# EAGLE design bunny_light (EAGLE 7.5.0)
CNAME: Arduino Bunny Nightlight; CREVISION: 1.1; DESIGNER: Nikita Pchelin
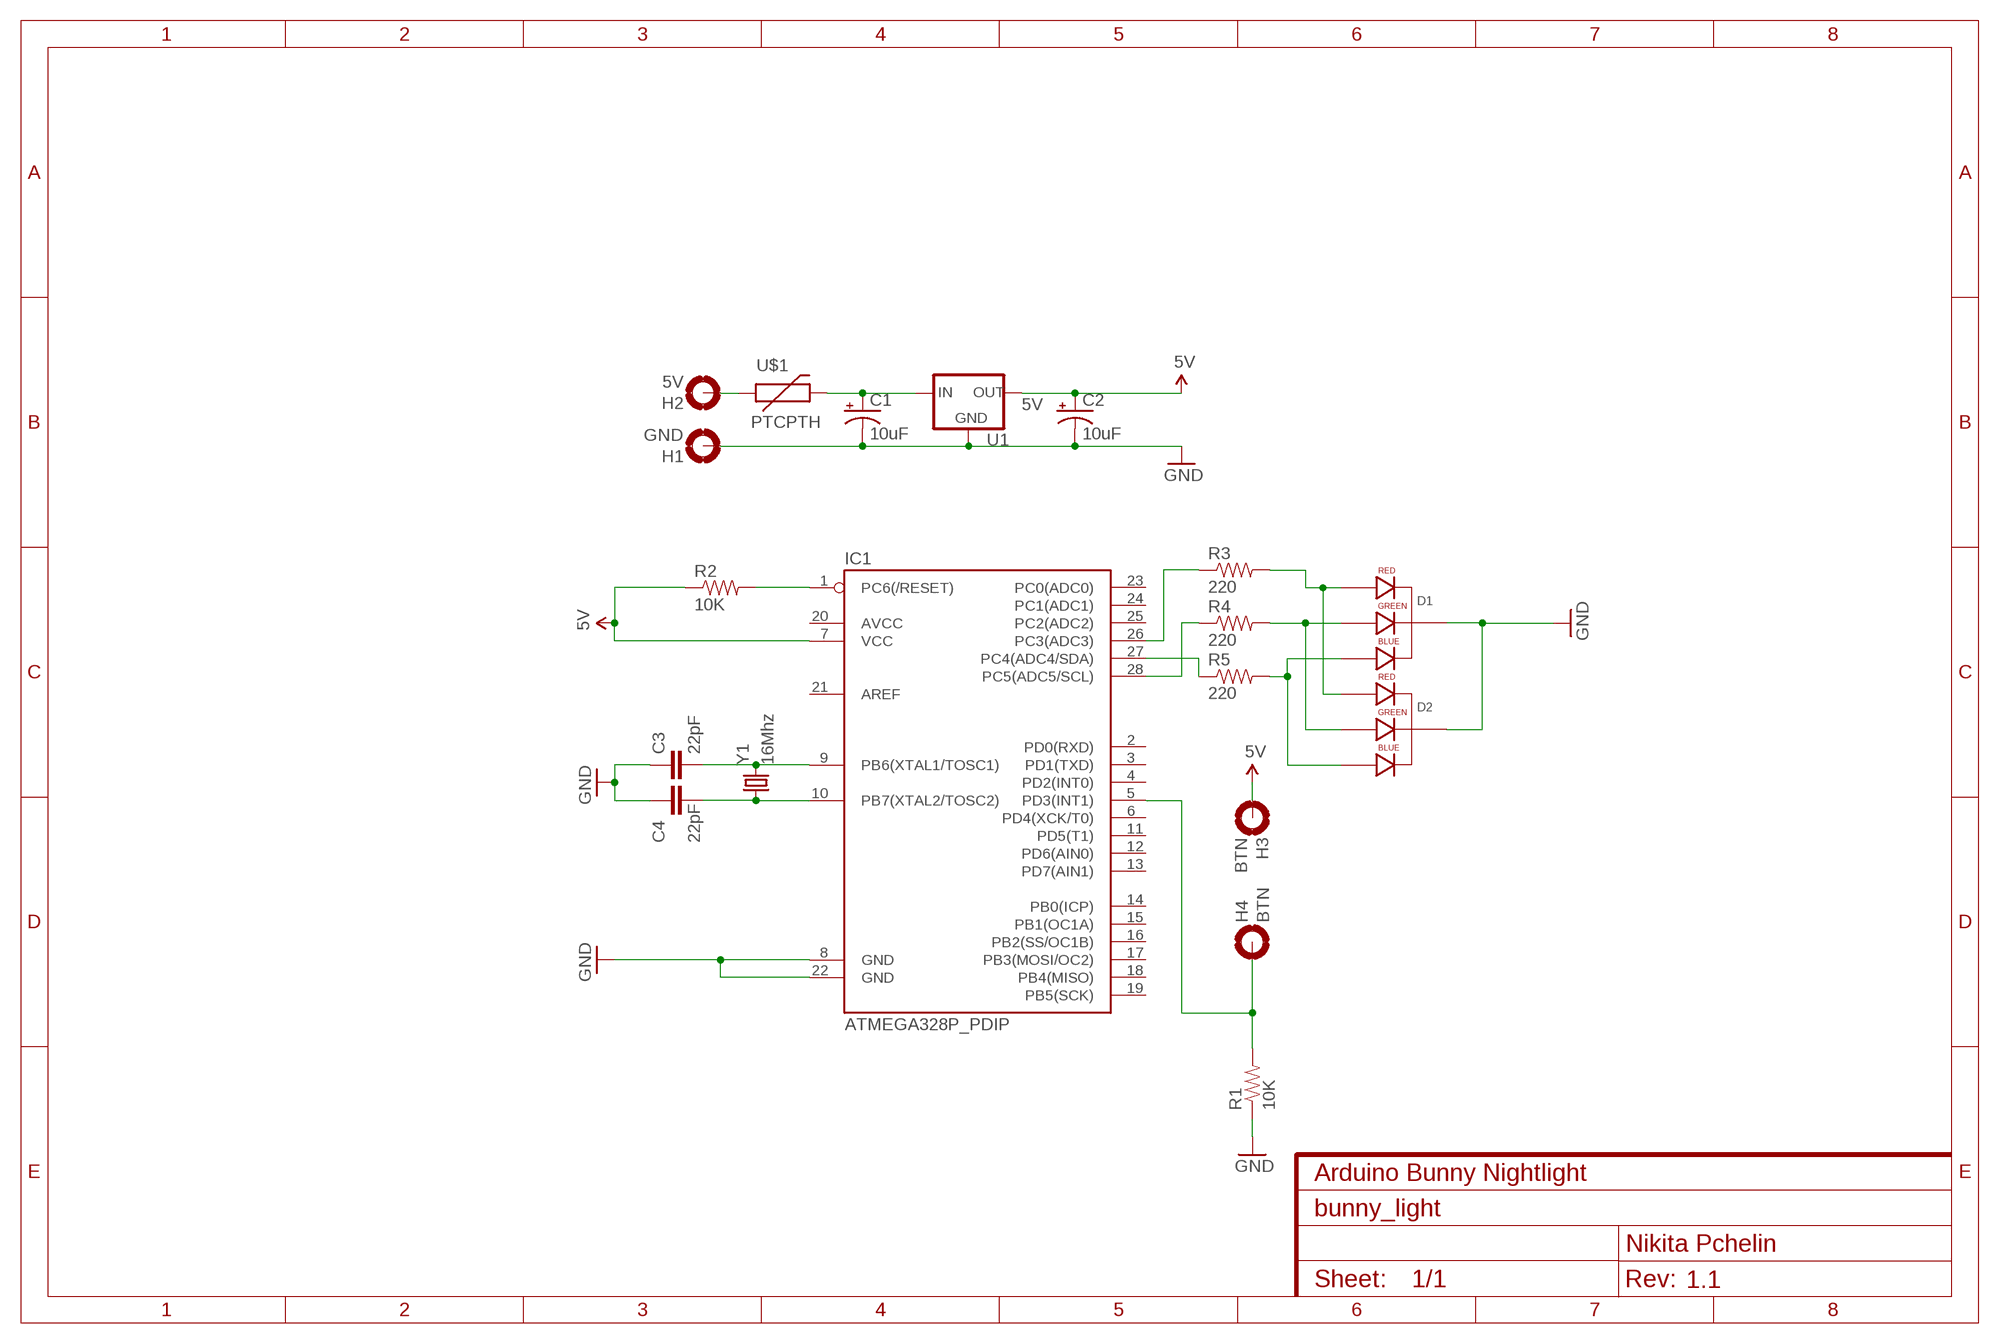
[diagram p0: schematic, sheet 1]

## Parts
C1  10uF  CAP_POLPTH1  [CPOL-RADIAL-100UF-25V]
C2  10uF  CAP_POLPTH1  [CPOL-RADIAL-100UF-25V]
C3  22pF  CAP_  [AXIAL-5MM]
C4  22pF  CAP_  [AXIAL-5MM]
D1  LED-RGB-CC-THRUCLEAR  [LED-RGB-THRU]
D2  LED-RGB-CC-THRUCLEAR  [LED-RGB-THRU]
H1  GND  MOUNT-PAD-ROUND2.8  [2,8-PAD]
H2  5V  MOUNT-PAD-ROUND2.8  [2,8-PAD]
H3  BTN  MOUNT-PAD-ROUND2.8  [2,8-PAD]
H4  BTN  MOUNT-PAD-ROUND2.8  [2,8-PAD]
IC1  ATMEGA328P_PDIP  [DIL28-3]
R1  10K  RESISTOREZ  [AXIAL-0.3EZ]
R2  10K  RESISTOREZ  [AXIAL-0.3EZ]
R3  220  RESISTOREZ  [AXIAL-0.3EZ]
R4  220  RESISTOREZ  [AXIAL-0.3EZ]
R5  220  RESISTOREZ  [AXIAL-0.3EZ]
U1  5V  V_REG_78XXSIDE  [78XXL]
U$1  PTCPTH  [PTC]
Y1  16Mhz  CRYSTALHC49US  [HC49US]

## Nets
5V: C2.1(+) H3.B2,8(MOUNT) IC1.7(VCC) R2.P$1 U1.OUT
GND: C1.2(-) C2.2(-) C3.P$1 C4.P$1 D1.2(CATHODE) D2.2(CATHODE) H1.B2,8(MOUNT) IC1.8(GND) IC1.22(GND) R1.P$1 U1.GND
N$1: C1.1(+) U1.IN U$1.P$2
N$2: C3.P$2 IC1.9(PB6(XTAL1/TOSC1)) Y1.2
N$3: C4.P$2 IC1.10(PB7(XTAL2/TOSC2)) Y1.1
N$4: IC1.1(PC6(/RESET)) R2.P$2
N$5: H4.B2,8(MOUNT) IC1.5(PD3(INT1)) R1.P$2
N$6: D1.1(RED_CATHODE) D2.1(RED_CATHODE) R3.P$2
N$7: D1.3(GREEN_CATHODE) D2.3(GREEN_CATHODE) R4.P$2
N$8: D1.4(BLUE_CATHODE) D2.4(BLUE_CATHODE) R5.P$2
N$9: IC1.26(PC3(ADC3)) R3.P$1
N$10: IC1.28(PC5(ADC5/SCL)) R4.P$1
N$11: IC1.27(PC4(ADC4/SDA)) R5.P$1
N$12: H2.B2,8(MOUNT) U$1.P$1
Unconnected: IC1.2(PD0(RXD)) IC1.3(PD1(TXD)) IC1.4(PD2(INT0)) IC1.6(PD4(XCK/T0)) IC1.11(PD5(T1)) IC1.12(PD6(AIN0)) IC1.13(PD7(AIN1)) IC1.14(PB0(ICP)) IC1.15(PB1(OC1A)) IC1.16(PB2(SS/OC1B)) IC1.17(PB3(MOSI/OC2)) IC1.18(PB4(MISO)) IC1.19(PB5(SCK)) IC1.20(AVCC) IC1.21(AREF) IC1.23(PC0(ADC0)) IC1.24(PC1(ADC1)) IC1.25(PC2(ADC2))

## Library data of the parts
C1 C2 = SparkFun-Capacitors:CAP_POL: Capacitor Polarized These are standard SMD and PTH capacitors. Normally 10uF, 47uF, and 100uF in electrolytic and tantalum varieties. Always verify the external diameter of the through hole cap, it varies with capacity, voltage, and manufacturer. The EIA devices should be standard.
C3 C4 = SparkFun-Passives:CAP: Capacitor Standard 0603 ceramic capacitor, and 0.1" leaded capacitor.
D1 D2 = SparkFun-LED:LED-RGB-CC-THRU: RGB Through-hole common cathode LED SparkFun Storefront: COM-00105 (Clear) COM-09264 (Diffuse); PROD_ID: DIO-08418
H1-H4 = holes:MOUNT-PAD-ROUND: MOUNTING PAD, round
IC1 = SparkFun-DigitalIC:ATMEGA328P_PDIP: uC used in the Arduino 32kb flash, 1k EEPROM, 2k SRAM This is the through-hole version of this chip.
R1-R5 = SparkFun-Resistors:RESISTOR: Resistor Basic schematic elements and footprints for 0603, 1206, and PTH resistors.
U1 = SparkFun-PowerIC:V_REG_78XX: Voltage Regulator Standard 78xx regulator. IGO (Input Ground Output). Spark Fun Electronics SKU : COM-00107
U$1 = SparkFun-PowerIC:PTC: Resettable Fuse PTC Resettable Fuse. Spark Fun Electronics SKU : COM-08357
Y1 = SparkFun-FreqCtrl:CRYSTAL: Various standard crystals. Proven footprints.

## Board
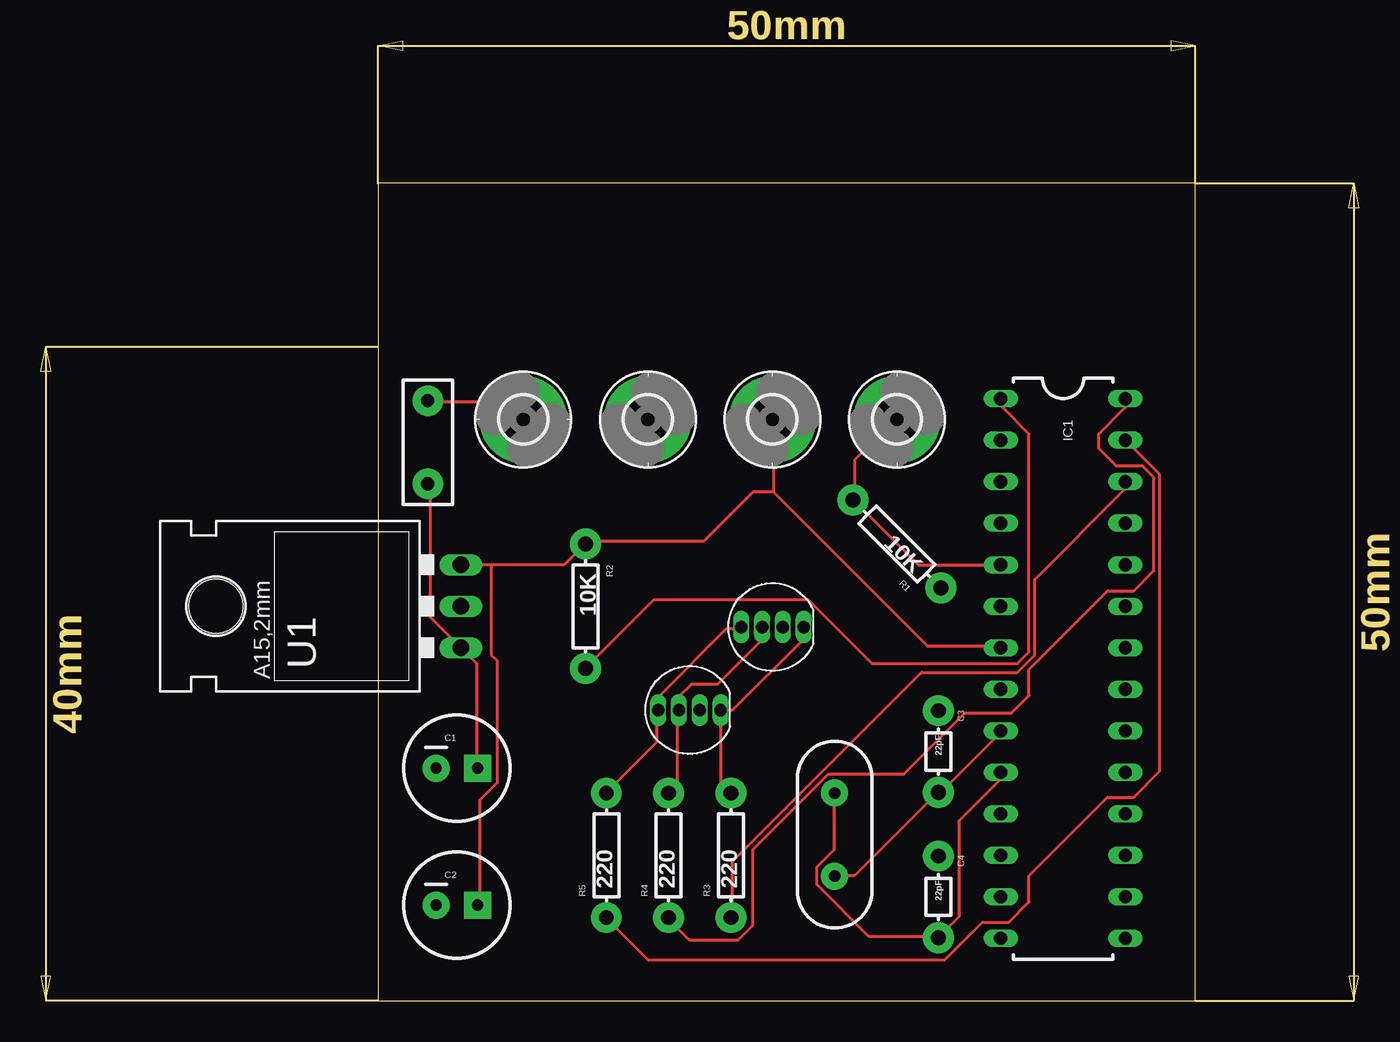
[diagram p1: board, top side]
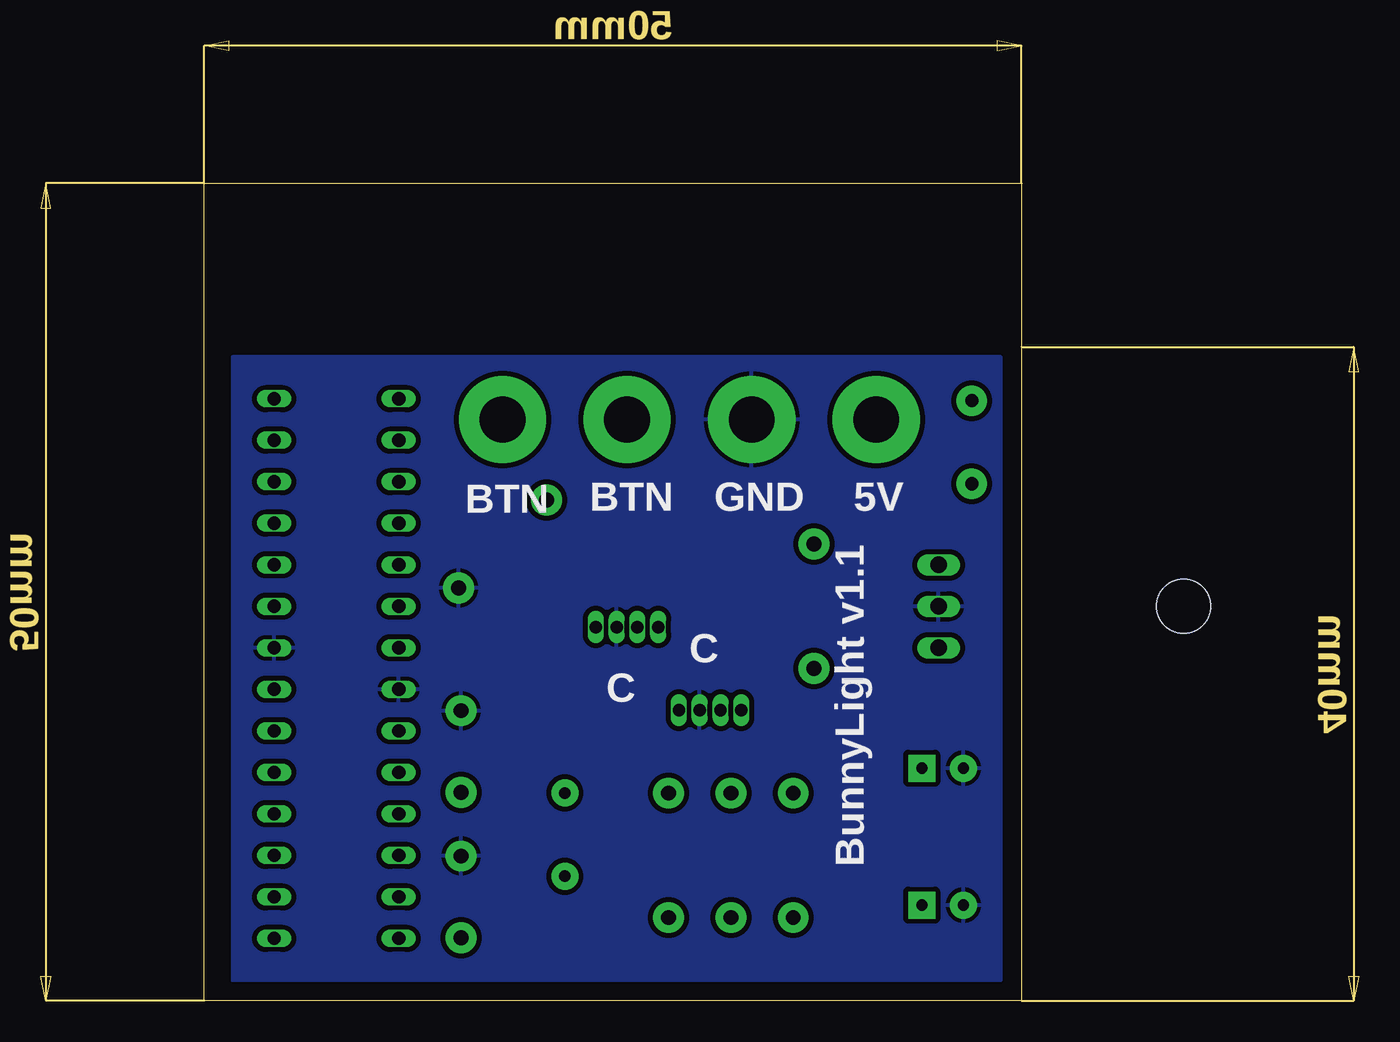
[diagram p2: board, bottom side, seen from below]

Size 50 x 50 mm. Coordinates in mm from the lower left corner, seen from the top.
Outline: 0,0 50,0 50,50 0,50 0,0
Copper layers (1*16): Top 0.035mm / dielectric 1.5mm / Bottom 0.035mm
Design rules "ShenZhen2U EagleRules *": minimum track width 7mil, minimum drill 12mil, track to track 7mil, track to pad 7mil, pad to pad 7mil, via to via 7mil, smd to smd 0mil, copper to edge 20mil, drill to drill 10mil, minimum pad ring 0mil, minimum via ring 6mil, stop-mask expansion 2mil, vias tented up to drill 25mil, thermal gap 10mil

### Footprints (pad centres in the part's own frame; a part is rotated, then mirrored left to right if it is on the bottom)
CPOL-RADIAL-100UF-25V = drill 0.7 pad 1.651 square: 1 1.27,0 | drill 0.7 pad 1.651: 2 -1.27,0
AXIAL-5MM = drill 0.9 pad 1.88: P$1 -2.5,0; P$2 2.5,0
LED-RGB-THRU = drill 0.762 pad 0.889 long: 1 1.905,0; 2 0.635,0; 3 -0.635,0; 4 -1.905,0
2,8-PAD = drill 2.8 pad 5.334: B2,8 0,0
DIL28-3 = drill 0.813 long: 1 -16.51,-3.81; 2 -13.97,-3.81; 3 -11.43,-3.81; 4 -8.89,-3.81; 5 -6.35,-3.81; 6 -3.81,-3.81; 7 -1.27,-3.81; 8 1.27,-3.81; 9 3.81,-3.81; 10 6.35,-3.81; 11 8.89,-3.81; 12 11.43,-3.81; 13 13.97,-3.81; 14 16.51,-3.81; 15 16.51,3.81; 16 13.97,3.81; 17 11.43,3.81; 18 8.89,3.81; 19 6.35,3.81; 20 3.81,3.81; 21 1.27,3.81; 22 -1.27,3.81; 23 -3.81,3.81; 24 -6.35,3.81; 25 -8.89,3.81; 26 -11.43,3.81; 27 -13.97,3.81; 28 -16.51,3.81
AXIAL-0.3EZ = drill 0.9 pad 1.88: P$1 -3.81,0; P$2 3.81,0
78XXL = drill 1.016 long: GND 0,-3.81; IN -2.54,-3.81; OUT 2.54,-3.81 | hole 3.302: 0,11.176
PTC = drill 0.8 pad 1.88: P$1 -2.54,0; P$2 2.54,0
HC49US = drill 0.7 pad 1.651: 1 -2.54,0; 2 2.54,0

### Placement (x,y rotation side)
C1  4.83,14.22 0 top
C2  4.83,5.84 0 top
C3  34.29,15.24 270 top
C4  34.29,6.35 270 top
D1  24.13,22.86 0 top
D2  19.05,17.78 0 top
H1  16.51,35.56 0 top
H2  8.89,35.56 270 top
H3  24.13,35.56 180 top
H4  31.75,35.56 0 top
IC1  41.91,20.32 270 top
R1  31.75,27.94 135 top
R2  12.7,24.13 270 top
R3  21.59,8.89 90 top
R4  17.78,8.89 90 top
R5  13.97,8.89 90 top
U1  1.27,24.13 90 top
U$1  3.05,34.16 270 top
Y1  27.94,10.16 270 top

### Tracks (layer width: path | path; a pad name or v marks a point on that pad's centre or on a via)
5V
  Top 0.178: 6.93,26.67 11.38,26.67 12.62,27.91 R2.P$1 12.8,28.09 19.91,28.09 22.94,31.11 24.18,31.11 | 6.93,26.67 U1.OUT | 6.93,26.67 6.93,21.16 7.29,20.8 7.29,13.34 6.22,12.27 6.22,5.87 C2.1 | 24.18,31.11 33.6,21.69 38.05,21.69 IC1.7 | 24.18,31.11 24.18,35.56 H3.B2,8
GND
  pour Bottom (isolate 0.305): 1.27,39.37 48.26,39.37 48.26,1.27 1.27,1.27
N$1
  Top 0.178: U$1.P$2 3.2,31.47 3.2,23.47 U1.IN 6.04,20.62 6.04,14.22 C1.1
N$2
  Top 0.178: IC1.9 38.05,16.36 34.31,12.62 C3.P$2 34.14,12.62 29.16,7.64 28.09,7.64 Y1.2
N$3
  Top 0.178: IC1.10 38.05,13.87 38.05,13.51 35.56,11.02 35.56,5.16 34.31,3.91 C4.P$2 34.14,3.91 30.05,3.91 26.85,7.11 26.85,8.18 27.91,9.25 27.91,12.62 Y1.1
N$4
  Top 0.178: IC1.1 38.23,36.8 38.23,36.27 39.83,34.67 39.83,21.34 39.12,20.62 30.23,20.62 26.31,24.54 16.89,24.54 12.8,20.45 R2.P$2
N$5
  Top 0.178: IC1.5 33.07,26.67 29.16,30.58 R1.P$2 29.16,30.76 29.16,33.07 31.65,35.56 H4.B2,8
N$6
  Top 0.178: 20.98,17.78 20.98,13.34 21.51,12.8 R3.P$2 | 20.98,17.78 21.69,17.78 25.96,22.05 25.96,22.76 D1.1 | 20.98,17.78 D2.1
N$7
  Top 0.178: R4.P$2 17.78,12.8 18.31,13.34 18.31,17.78 D2.3 18.49,17.78 18.49,18.67 19.2,19.38 20.8,19.38 23.47,22.05 23.47,22.76 D1.3
N$8
  Top 0.178: R5.P$2 14.05,12.8 17.07,15.82 17.07,17.78 D2.4 17.25,17.78 17.25,18.67 21.34,22.76 22.23,22.76 D1.4
N$9
  Top 0.178: IC1.26 45.7,31.65 45.7,31.29 40.18,25.78 40.18,21.16 39.12,20.09 33.25,20.09 21.69,8.53 21.69,5.16 R3.P$1
N$10
  Top 0.178: IC1.28 45.7,36.8 45.7,36.27 44.09,34.67 44.09,33.78 45.16,32.72 46.76,32.72 47.47,32 47.47,26.31 46.23,25.07 44.63,25.07 39.83,20.27 39.83,18.67 38.76,17.6 35.92,17.6 32.18,13.87 27.56,13.87 22.94,9.25 22.94,4.62 22.05,3.73 19.02,3.73 17.78,4.98 R4.P$1
N$11
  Top 0.178: IC1.27 47.83,32.18 47.83,14.05 46.23,12.45 44.63,12.45 39.83,7.64 39.83,6.04 38.58,4.8 36.98,4.8 34.67,2.49 16.54,2.49 14.05,4.98 R5.P$1
N$12
  Top 0.178: H2.B2,8 7.82,36.63 3.2,36.63 U$1.P$1

### Text on the board
bNames: 5V | GND | BTN | BTN | BunnyLight v1.1 | C | C